# Altium schematic sheet [2]STM32F334R8T6Board_Display_WIFI.SchDoc
size B
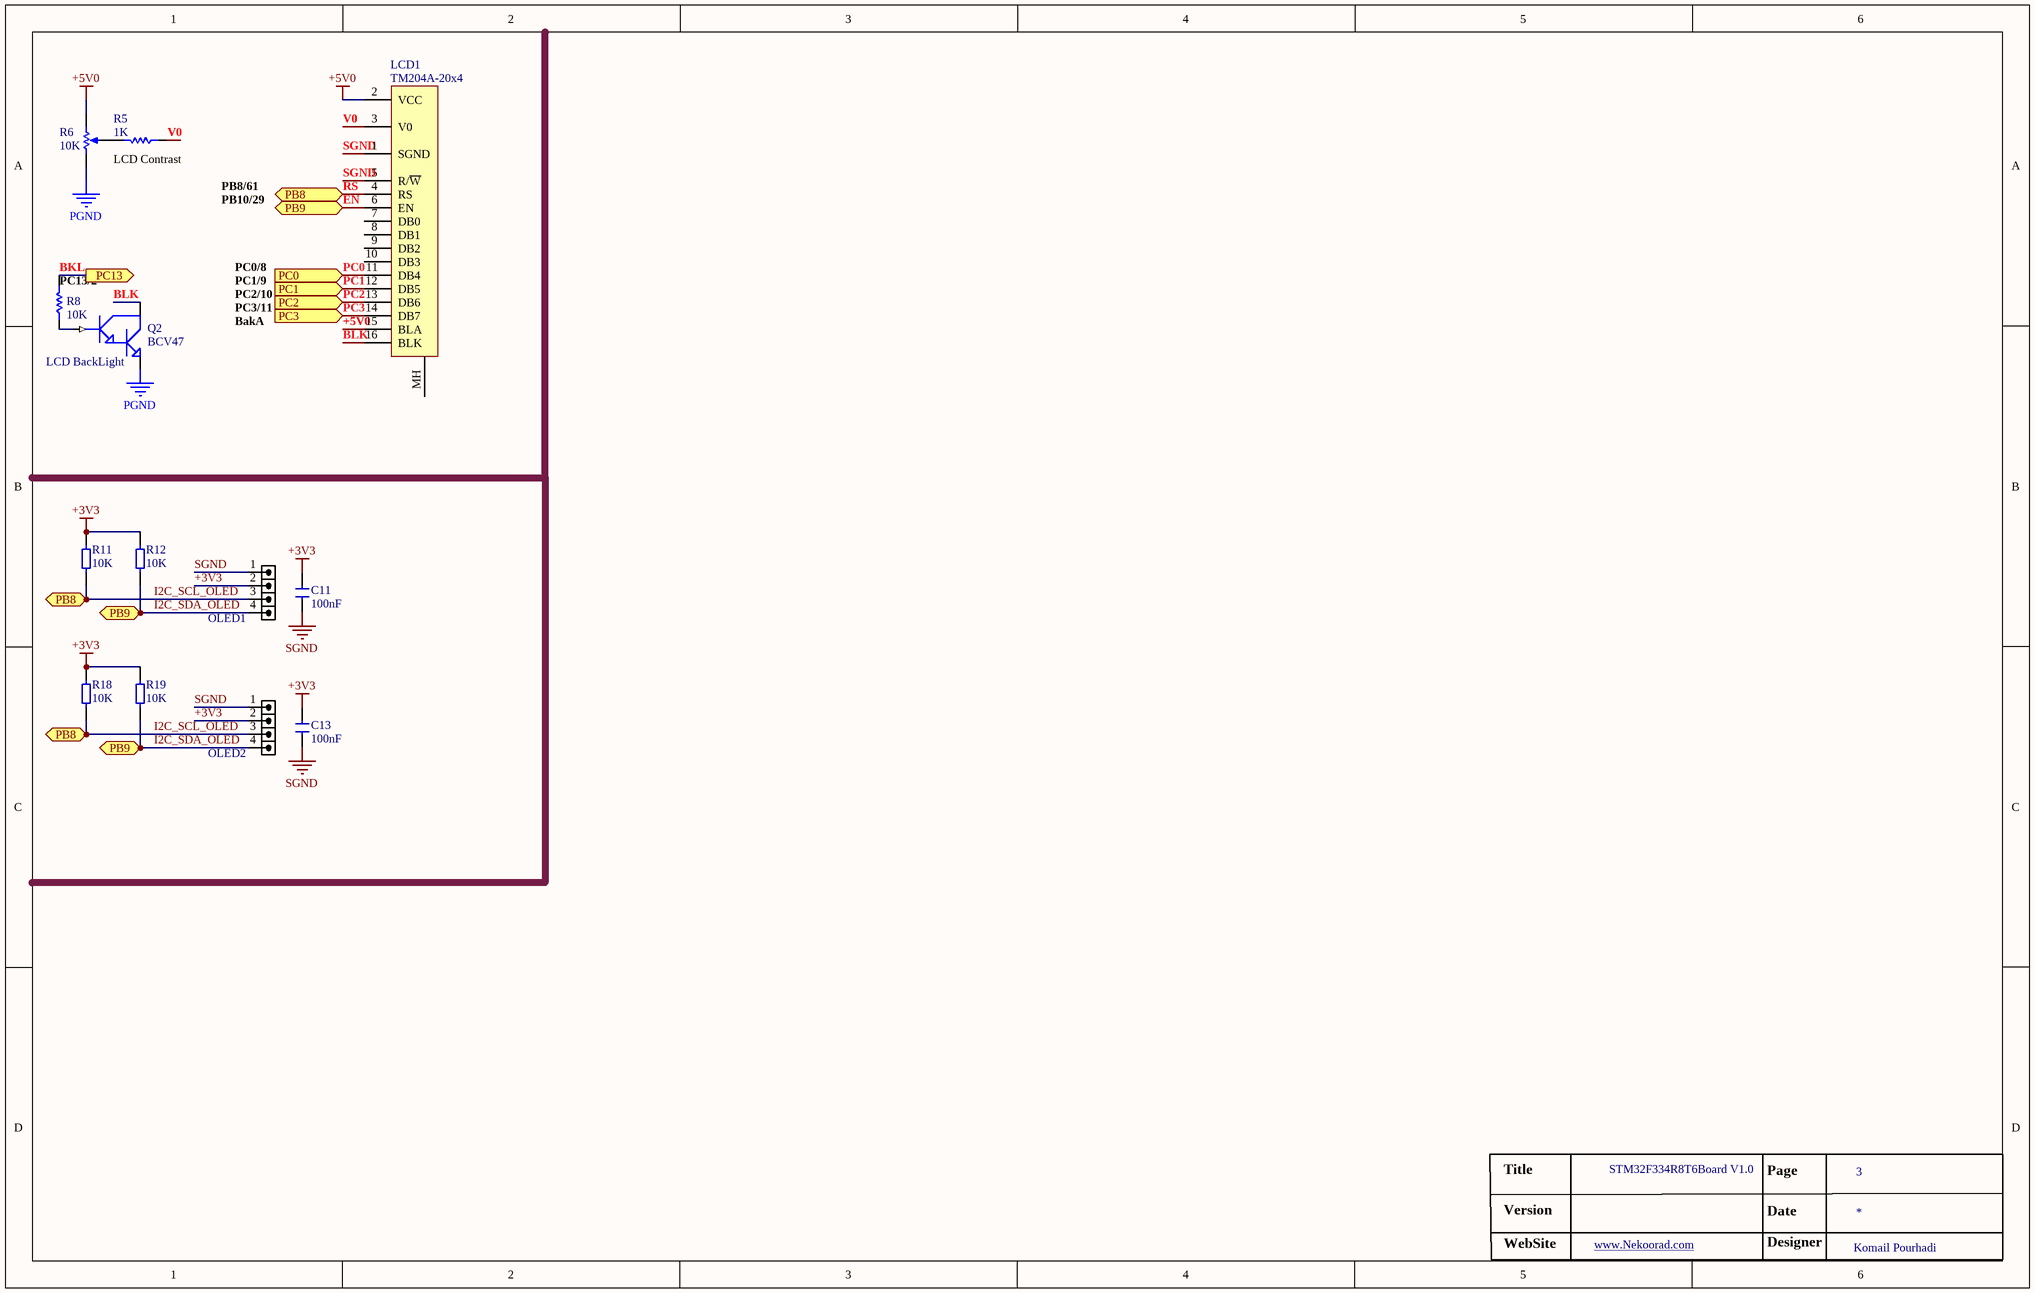
[diagram p0: [2]STM32F334R8T6Board_Display_WIFI.SchDoc]

## Parts
C11  Capacitor SMD  [SMD_CAP_1206]  (value not drawn)
C13  Capacitor SMD  [SMD_CAP_1206]  (value not drawn)
LCD1  TM204A-20x4  [HDR1X16]
OLED1  HDR1X4  [HDR1X4]  (value not drawn)
OLED2  HDR1X4  [HDR1X4]  (value not drawn)
Q2  BCV47  [SOT23_BEC_M]
R5  1K  [RES_1206]
R6  value 10K  [JFP]  (hidden comment: RPot)
R8  10K  [RES_1206]
R11  RESISTOR  [RES_1206]  (value not drawn)
R12  RESISTOR  [RES_1206]  (value not drawn)
R18  RESISTOR  [RES_1206]  (value not drawn)
R19  RESISTOR  [RES_1206]  (value not drawn)

## Ports
PB8 (bidir), PB9 (bidir), PC0 (in), PC1 (in), PC2 (in), PC3 (in), PC13 (out)

## Nets
+3V3: C11.2 C13.2 OLED1.2 OLED2.2 R11.1 R12.1 R18.1 R19.1
+5V0: LCD1.2(VCC) LCD1.15(BLA) R6.3(BOT)
PGND: Q2.2(E) R6.1(TOP)
SGND: C11.1 C13.1 LCD1.1(SGND) LCD1.5(R/~{W}) OLED1.1 OLED2.1
BKL: R8.2 ; port PC13
BLK: LCD1.16(BLK) Q2.3(C)
EN: LCD1.6(EN) OLED1.4 OLED2.4 R12.2 R19.2 ; port PB9  [also labelled I2C_SDA_OLED]
I2C_SCL_OLED: LCD1.4(RS) OLED1.3 OLED2.3 R11.2 R18.2 ; port PB8  [also labelled RS]
PC0: LCD1.11(DB4) ; port PC0
PC1: LCD1.12(DB5) ; port PC1
PC2: LCD1.13(DB6) ; port PC2
PC3: LCD1.14(DB7) ; port PC3
V0: LCD1.3(V0) R5.1
NetQ2_1: Q2.1(B) R8.1
NetR5_2: R5.2 R6.2(TAP)

Not connected (* = marked no-connect by the designer): LCD1 7(DB0) 8(DB1) 9(DB2) 10(DB3) MH

## Notes on the sheet
- LCD Contrast
- PB8/61
- PB10/29
- (near R8) PC13/2
- PC0/8
- PC1/9
- PC2/10
- (near Q2) LCD BackLight
- BakA
- PC3/11
- Title
- STM32F334R8T6Board V1.0
- Page
- 3
- Version
- WebSite
- www.Nekoorad.com <http://www.Nekoorad.com>
- Date
- Designer
- Komail Pourhadi
- Size:
- Date:
- B
- Number:
- Time:
- Revision:
- Sheet
- of
- File:
- (in symbol Capacitor SMD) 100nF
- (in symbol Resistor SMD) 10K

## Library data of the parts
LCD1 = LCD: Designer: Saeid Jorablo; Company: My self; Adding Date: 10/21/2009; LCDType: TM204A-20x4
OLED1 OLED2 = HDR_M_1X4: CONN, HEADER, Male, pitch: 2.54mm, 4POS; VALUE: HDRM4
Q2 = NPN DAR
R5 R8 = Resistor: Tolerance: 5%; Power: 1/8 W
  R5: Value: 1K
  R8: Value: 10K
R6 = RPot: Potentiometer; Sim Note: Enter the Resistance value and the set point into parameter fields.; Set Position: 0.5; Published: 8-Jun-2000; LatestRevisionDate: 17-Jul-2002; LatestRevisionNote: Re-released for DXP Platform.; PackageReference: VR5; Publisher: Altium Limited; PackageDescription: Variable Resistor, Thru-Hole; 3 Leads
R11 R12 R18 R19 = Resistor SMD